# EAGLE design EM4095_base_circuit_w_series (EAGLE 7.5.0)
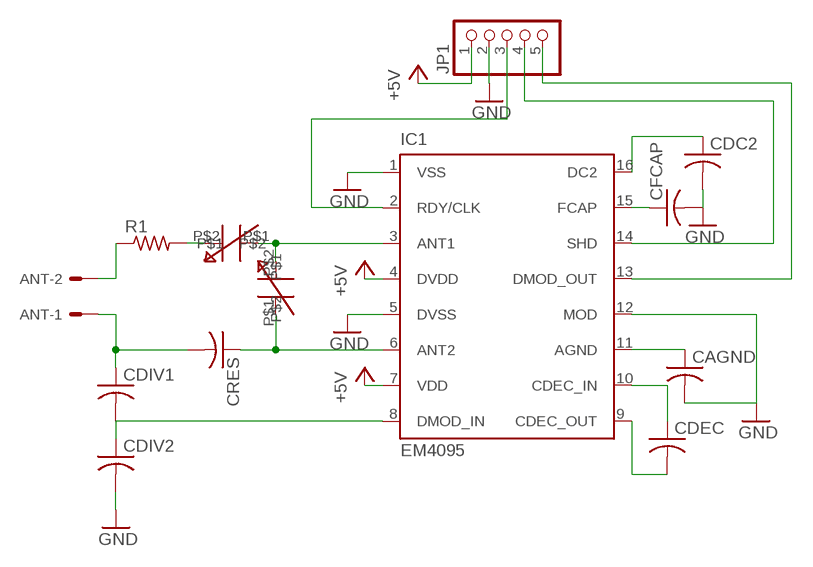
[diagram p0: schematic, sheet 1]

## Parts
ANT  KK-156-2  [KK-156-2]
CAGND  C-USC1206K  [C1206K]
CDC2  C-USC1206K  [C1206K]
CDEC  C-USC1206K  [C1206K]
CDIV1  C-USC1206K  [C1206K]
CDIV2  C-USC1206K  [C1206K]
CFCAP  C-USC1206K  [C1206K]
CRES  C-USC1206K  [C1206K]
IC1  EM4095  [SO16]
JP1  PINHD-1X5  [1X05]
R1  R-US_R1206  [R1206]
U$1  TZB4Z100AB10R00  [TZB4Z100AB10R00]
U$2  TZB4Z100AB10R00  [TZB4Z100AB10R00]

## Nets
+5V: IC1.4(DVDD) IC1.7(VDD) JP1.1
DMOD: IC1.13(DMOD_OUT) JP1.5
GND: CAGND.2 CDC2.2 CDIV2.2 CFCAP.2 IC1.1(VSS) IC1.5(DVSS) IC1.12(MOD) JP1.2
N$1: CFCAP.1 IC1.15(FCAP)
N$2: CAGND.1 IC1.11(AGND)
N$3: CRES.1 IC1.6(ANT2) U$1.P$1
N$4: CDIV1.2 CDIV2.1 IC1.8(DMOD_IN)
N$5: ANT.1 CDIV1.1 CRES.2
N$6: R1.2 U$2.P$2
N$7: IC1.3(ANT1) U$1.P$2 U$2.P$1
N$8: CDC2.1 IC1.16(DC2)
N$9: ANT.2 R1.1
N$11: CDEC.2 IC1.9(CDEC_OUT)
N$12: CDEC.1 IC1.10(CDEC_IN)
RDY: IC1.2(RDY/CLK) JP1.3
SLP: IC1.14(SHD) JP1.4

## Library data of the parts
ANT = con-molex:KK-156-2: KK 156 HEADER Source: http://www.molex.com/pdm_docs/sd/026604100_sd.pdf; OC_FARNELL: unknown; OC_NEWARK: unknown
CAGND CDC2 CDEC CDIV1 CDIV2 CFCAP CRES = rcl:C-US: CAPACITOR, American symbol
IC1 = em-microelectronic:EM4095: Read/Write analog front end for 125kHz RFID Basestation Source: http://www.emmicroelectronic.com/webfiles/Product/RFID/DS/EM4095_DS.pdf
JP1 = pinhead:PINHD-1X5: PIN HEADER
R1 = rcl:R-US_: RESISTOR, American symbol
U$1 U$2 = mylibrary:TZB4Z100AB10R00

## Board
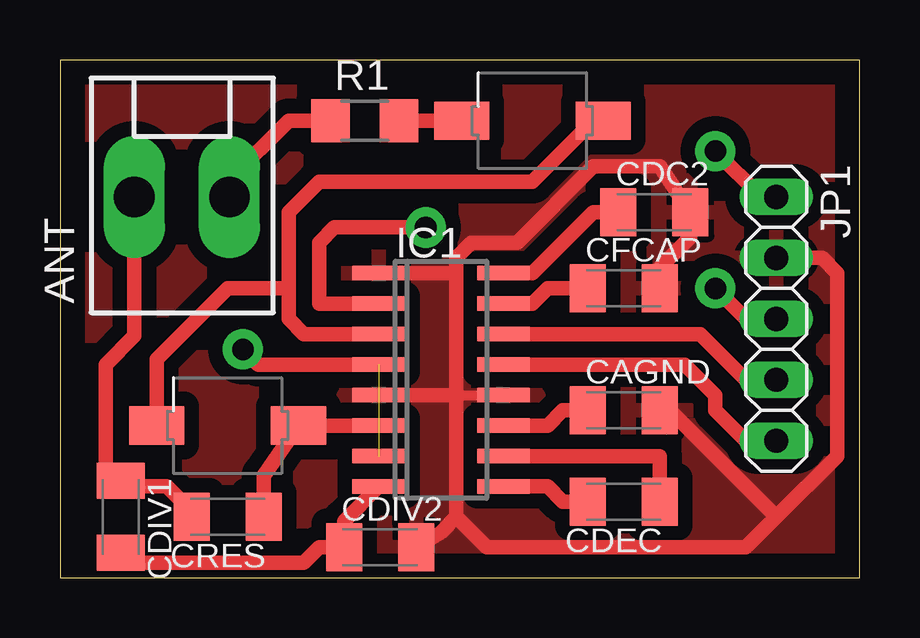
[diagram p1: board, top side]
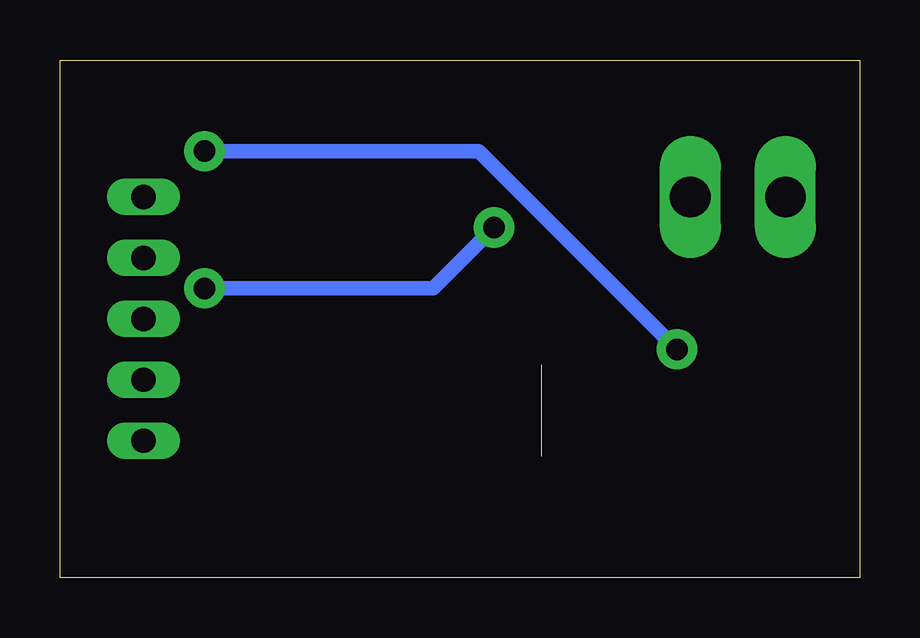
[diagram p2: board, bottom side, seen from below]

Size 33.33 x 21.58 mm. Coordinates in mm from the lower left corner, seen from the top.
Outline: 0,0 33.33,0 33.33,21.58 0,21.58 0,0
Copper layers (1*16): Top 0.035mm / dielectric 1.5mm / Bottom 0.035mm
Design rules "default": minimum track width 10mil, minimum drill 24mil, track to track 8mil, track to pad 8mil, pad to pad 8mil, via to via 8mil, smd to smd 8mil, copper to edge 40mil, drill to drill 8mil, minimum pad ring 10mil, minimum via ring 8mil, stop-mask expansion 4mil, vias tented up to drill 0mil, thermal gap 10mil

### Footprints (pad centres in the part's own frame; a part is rotated, then mirrored left to right if it is on the bottom)
KK-156-2 = drill 1.7 pad 2.184 long: 1 -1.98,0; 2 1.98,0
C1206K = smd 1.5 x 2: 1 -1.5,0; 2 1.5,0
SO16 = smd 0.6 x 2.2: 1 -4.445,-2.6; 2 -3.175,-2.6; 3 -1.905,-2.6; 4 -0.635,-2.6; 5 0.635,-2.6; 6 1.905,-2.6; 7 3.175,-2.6; 8 4.445,-2.6; 9 4.445,2.6; 10 3.175,2.6; 11 1.905,2.6; 12 0.635,2.6; 13 -0.635,2.6; 14 -1.905,2.6; 15 -3.175,2.6; 16 -4.445,2.6
1X05 = drill 1.016 long: 1 -5.08,0; 2 -2.54,0; 3 0,0; 4 2.54,0; 5 5.08,0
R1206 = smd 1.6 x 1.803: 1 -1.422,0; 2 1.422,0
TZB4Z100AB10R00 = smd 2.3 x 1.6: P$1 2.95,0; P$2 -2.95,0

### Placement (x,y rotation side)
ANT  5.08,15.88 0 top
CAGND  23.5,6.99 0 top
CDC2  24.77,15.24 0 top
CDEC  23.5,3.17 180 top
CDIV1  2.54,2.54 270 top
CDIV2  13.33,1.27 0 top
CFCAP  23.5,12.06 0 top
CRES  6.98,2.54 180 top
IC1  15.88,8.26 270 top
JP1  29.84,10.79 270 top
R1  12.7,19.05 0 top
U$1  6.98,6.35 0 top
U$2  19.68,19.05 0 top

### Tracks (layer width: path | path; a pad name or v marks a point on that pad's centre or on a via)
+5V  (via drill 0.9 pad 1.68)  (1 unrouted)
  Top 0.61: v27.3,17.78 29.21,15.88 JP1.1 | IC1.4 8.26,8.89 v7.62,9.53
  Bottom 0.61: v27.3,17.78 15.88,17.78 v7.62,9.53
DMOD
  Top 0.61: IC1.13 26.04,8.89 27.3,7.62 27.3,6.99 28.57,5.71 JP1.5
GND
  Top 0.406: 16.51,7.62 IC1.12
  Top 0.61: IC1.5 16.51,7.62 | IC1.1 16.51,12.7 | 16.51,12.7 16.51,7.62 | 16.51,2.54 16.51,7.62 | CAGND.2 25.4,6.99 29.84,2.54 | JP1.2 31.75,13.34 32.38,12.7 32.38,5.08 29.84,2.54 | 29.84,2.54 28.57,1.27 17.78,1.27 16.51,2.54 | 16.51,12.7 16.51,13.34 17.14,13.97 19.05,13.97 22.22,17.14 25,17.14 CDC2.2 26.27,14.2 25,12.93 CFCAP.2 | CDIV2.2 15.88,1.91 16.51,2.54
  pour Top (isolate 0.61): 0,21.59 33.02,21.59 33.02,0 0,0
N$1
  Top 0.61: CFCAP.1 20.32,12.06 19.68,11.43 IC1.15
N$2
  Top 0.61: IC1.11 20.32,6.35 20.95,6.99 CAGND.1
N$3
  Top 0.61: IC1.6 U$1.P$1 8.48,4.26 CRES.1
N$4
  Top 0.61: CDIV1.2 2.95,0.64 10.16,0.64 10.79,1.27 CDIV2.1 11.83,2.37 IC1.8
N$5
  Top 0.61: CRES.2 5.48,2.77 4.45,3.81 2.77,3.81 CDIV1.1 2.31,4.04 1.91,4.45 1.91,8.89 3.1,10.09 ANT.1
N$6
  Top 0.61: U$2.P$2 R1.2
N$7
  Top 0.61: U$2.P$1 22.22,19.05 19.68,16.51 10.79,16.51 9.53,15.24 9.53,12.06 | 9.53,12.06 9.53,10.79 10.16,10.16 IC1.3 | U$1.P$2 4.04,9.12 6.98,12.06 9.53,12.06
N$8
  Top 0.406: IC1.16 19.68,12.7
  Top 0.61: 19.68,12.7 22.22,15.24 CDC2.1
N$9
  Top 0.61: ANT.2 7.06,16.59 9.53,19.05 R1.1
N$10
  pour Top (isolate 0.61): 0,21.59 26.04,21.59 26.04,0 0,0
N$11
  Top 0.61: IC1.9 20.32,3.81 20.95,3.17 CDEC.2
N$12
  Top 0.61: IC1.10 25,5.08 CDEC.1
RDY  (via drill 0.9 pad 1.68)
  Top 0.61: IC1.2 10.79,11.43 10.79,13.97 11.43,14.61 v15.24,14.61 | v27.3,12.06 28.57,10.79 JP1.3
  Bottom 0.61: v15.24,14.61 17.78,12.06 v27.3,12.06
SLP
  Top 0.61: IC1.14 26.67,10.16 28.57,8.26 JP1.4